# Altium project smarchSettlers.PrjPcb
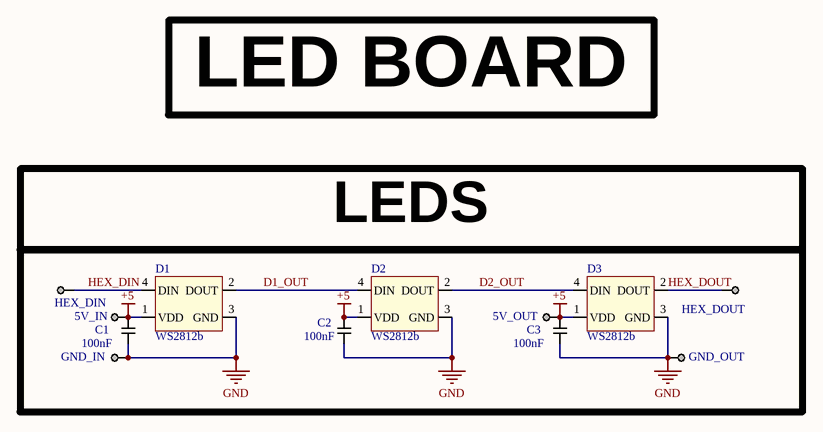
[diagram p0: Main.SchDoc]
1 sheet, 12 parts. Net scope: global (net labels, ports and power ports of the same name join across sheets).

## Sheet Main.SchDoc
size A

### Parts
5V_IN  18 AWG Hole  [18 AWG Hole]  (value not drawn)  (no BOM)
5V_OUT  18 AWG Hole  [18 AWG Hole]  (value not drawn)  (no BOM)
C1  100nF  [CAP_0805_HIGH]
C2  100nF  [CAP_0805_HIGH]
C3  100nF  [CAP_0805_HIGH]
D1  WS2812b  [WS2812b]
D2  WS2812b  [WS2812b]
D3  WS2812b  [WS2812b]
GND_IN  18 AWG Hole  [18 AWG Hole]  (value not drawn)  (no BOM)
GND_OUT  18 AWG Hole  [18 AWG Hole]  (value not drawn)  (no BOM)
HEX_DIN  18 AWG Hole  [18 AWG Hole]  (value not drawn)  (no BOM)
HEX_DOUT  18 AWG Hole  [18 AWG Hole]  (value not drawn)  (no BOM)

### Nets
+5: 5V_IN.1 5V_OUT.1 C1.2 C2.2 C3.2 D1.1(VDD) D2.1(VDD) D3.1(VDD)
GND: C1.1 C2.1 C3.1 D1.3(GND) D2.3(GND) D3.3(GND) GND_IN.1 GND_OUT.1
D1_OUT: D1.2(DOUT) D2.4(DIN)
D2_OUT: D2.2(DOUT) D3.4(DIN)
HEX_DIN: D1.4(DIN) HEX_DIN.1
HEX_DOUT: D3.2(DOUT) HEX_DOUT.1

### Notes on the sheet
- LED BOARD
- LEDS

### Library data of the parts
C1-C3 = Capacitor_0805: 0805 Capacitor
D1-D3 = WS2812b: WS2812b LED RGB